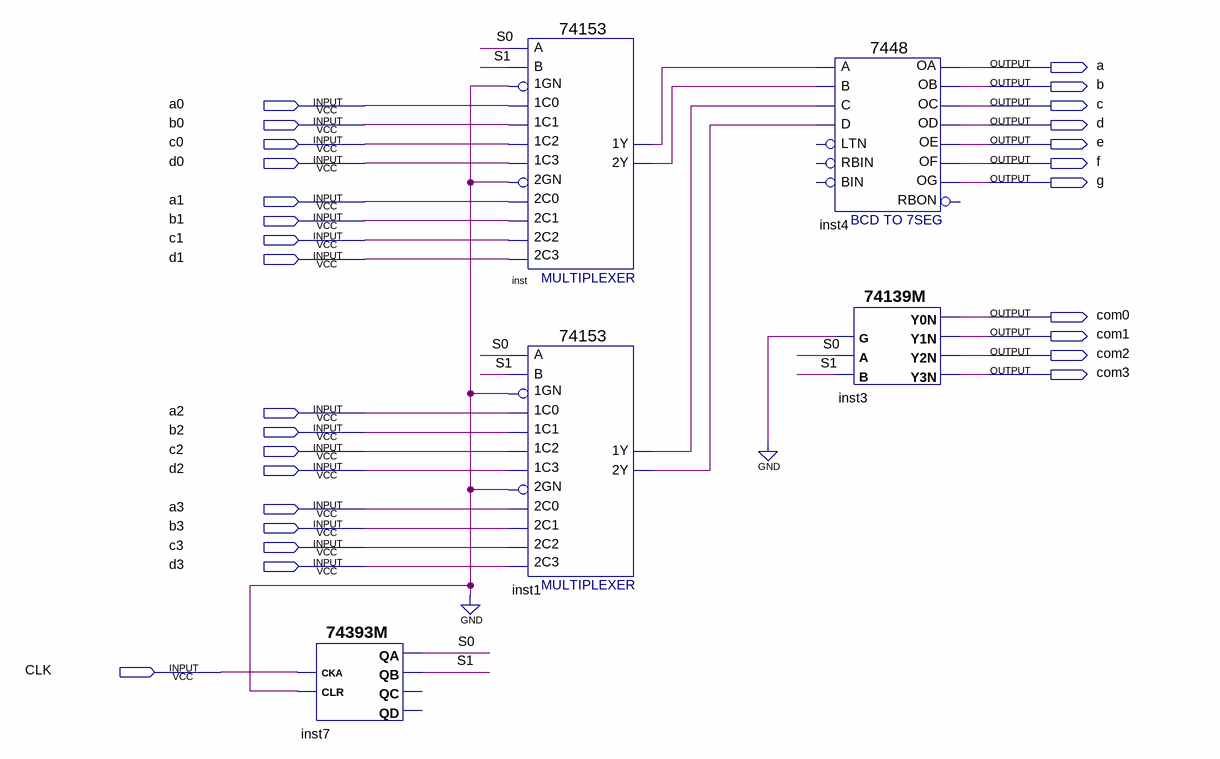
[diagram p0: schematic sheet]
// Quartus schematic disp.bdf as structural Verilog: 5 symbols, 28 pins
module disp (
  input  a0,
  input  b0,
  input  c0,
  input  d0,
  input  a1,
  input  b1,
  input  c1,
  input  d1,
  input  a2,
  input  b2,
  input  c2,
  input  d2,
  input  a3,
  input  b3,
  input  c3,
  input  d3,
  input  CLK,
  output a,
  output b,
  output c,
  output d,
  output e,
  output f,
  output g,
  output com0,
  output com1,
  output com2,
  output com3
);

  wire inst1_1y, inst1_2y, inst_1y, inst_2y, S0, S1;

  \74393M  inst7 (.CLR(1'b0), .CKA(CLK), .QB(S1), .QA(S0));  // open: QC, QD
  \74153  inst (
    .\1C1 (b0), .\1GN (1'b0), .\1C0 (a0), .\2C0 (a1), .\2GN (1'b0), .\2C2 (c1), .\1C2 (c0), .\1C3 (d0),
    .B(S1), .A(S0), .\2C1 (b1), .\2C3 (d1), .\1Y (inst_1y), .\2Y (inst_2y));
  \74153  inst1 (
    .\1C1 (b2), .\1GN (1'b0), .\1C0 (a2), .\2C0 (a3), .\2GN (1'b0), .\2C2 (c3), .\1C2 (c2), .\1C3 (d2),
    .B(S1), .A(S0), .\2C1 (b3), .\2C3 (d3), .\1Y (inst1_1y), .\2Y (inst1_2y));
  \7448  inst4 (
    .A(inst_1y), .C(inst1_1y), .D(inst1_2y), .B(inst_2y), .OC(c), .OE(e), .OD(d), .OF(f), .OG(g), .OB(b),
    .OA(a));  // open: RBIN, BIN, LTN, RBON
  \74139M  inst3 (.B(S1), .A(S0), .G(1'b0), .Y3N(com3), .Y2N(com2), .Y0N(com0), .Y1N(com1));
endmodule
